# Altium schematic sheet Connectors.SchDoc
size A4; SheetNumber: 3; SheetTotal: 4
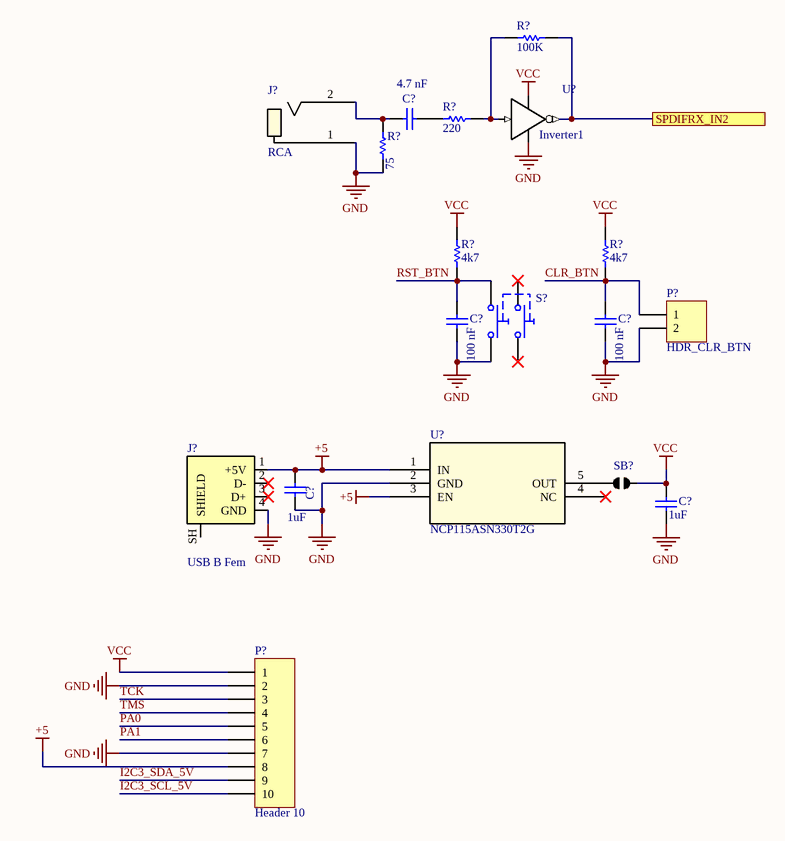
[diagram p0: Connectors.SchDoc]

## Parts
(Parts that share a designator on the sheet are numbered #1, #2 ... from top to bottom, then left to right.)
C?#1  value 4.7 nF  [RESC3216X70N]  (hidden comment: Cap)
C?#2  value 100 nF  [RESC3216X70N]  (hidden comment: Cap)
C?#3  value 100 nF  [RESC3216X70N]  (hidden comment: Cap)
C?#4  value 1uF  [CAPPRD250W50D655H1250]  (hidden comment: Cap)
C?#5  value 1uF  [CAPPRD250W50D655H1250]  (hidden comment: Cap)
J?#1  RCA  [KLPX-0848A-2-B_KYC]
J?#2  USB B Fem  [UJ2BH1TH]
P?#1  HDR_CLR_BTN  [HDR1X2]
P?#2  Header 10  [HDR1X10]
R?#1  value 100K  [RESC3216X70N]  (hidden comment: Res1)
R?#2  value 220  [RESC3216X70N]  (hidden comment: Res1)
R?#3  value 75  [RESC3216X70N]  (hidden comment: Res1)
R?#4  value 4k7  [RESC3216X70N]  (hidden comment: Res1)
R?#5  value 4k7  [RESC3216X70N]  (hidden comment: Res1)
S?  Doubl-Pole, Single-Throw Button  [TS026655BK160LCRD]  (value not drawn)
SB?  Solder Bridge  [Solder Bridge]  (value not drawn)
U?#1  Inverter1  [DBV5-M]
U?#2  NCP115ASN330T2G  [SOT95P275X120-5N]

## Ports
SPDIFRX_IN2

## Nets
+5: C?#4.2 J?#2.1(+5V) P?#2.8 U?#2.1(IN) U?#2.3(EN)
GND: C?#2.1 C?#3.1 C?#4.1 C?#5.1 J?#1.1 J?#2.4(GND) P?#1.2 P?#2.2 P?#2.7 R?#3.1 S?.4 U?#1.3(GND) U?#2.2(GND)
VCC: C?#5.2 P?#2.1 R?#4.1 R?#5.1 SB?.2 U?#1.5(VCC)
CLR_BTN: C?#3.2 P?#1.1 R?#5.2
I2C3_SCL_5V: P?#2.10
I2C3_SDA_5V: P?#2.9
PA0: P?#2.5
PA1: P?#2.6
RST_BTN: C?#2.2 R?#4.2 S?.3
SPDIFRX_IN2: R?#1.1 U?#1.4(Y) ; port SPDIFRX_IN2
TCK: P?#2.3
TMS: P?#2.4
NetC?#1_1: C?#1.1 J?#1.2 R?#3.2
NetC?#1_2: C?#1.2 R?#2.2
NetR?#1_2: R?#1.2 R?#2.1 U?#1.2(A)
NetSB?_1: SB?.1 U?#2.5(OUT)

Not connected (* = marked no-connect by the designer): J?#2 2(D-)* 3(D+)* SH(SHIELD); S? 1* 2*; U?#2 4(NC)*

## Library data of the parts
C?#1-C?#5 = Cap: Capacitor; Published: 8-Jun-2000; LatestRevisionDate: 17-Jul-2002; LatestRevisionNote: Re-released for DXP Platform.; PackageReference: RAD-0.3; Publisher: Altium Limited; PackageDescription: Radial Cap, Thru-Hole; 2 Leads; 0.3 in Pin Spacing
J?#1 = KLPX-0848A-2-B: No Description Available; Mfr_Name: KYCON, INC.; Copyright: Copyright (C) 2023 Ultra Librarian. All rights reserved.; Manufacturer_Part_Number: KLPX-0848A-2-B; RefDes: RefDes; Type: DEV
J?#2 = USB B Fem: pin to pad: SH>MH
P?#1 = Header 2: Header, 2-Pin; LatestRevisionDate: 17-Jul-2002; LatestRevisionNote: Re-released for DXP Platform.; Publisher: Altium Limited
P?#2 = Header 10: Header, 10-Pin; LatestRevisionDate: 17-Jul-2002; LatestRevisionNote: Re-released for DXP Platform.; Publisher: Altium Limited
R?#1-R?#5 = Res1: Resistor; Published: 8-Jun-2000; LatestRevisionDate: 17-Jul-2002; LatestRevisionNote: Re-released for DXP Platform.; PackageReference: AXIAL-0.3; Publisher: Altium Limited; PackageDescription: Axial Device, Thru-Hole; 2 Leads; 0.3 in Pin Spacing
S? = DPST Push Button: closed: 0; Rclosed: 1m; Ropen: 1Meg; SimulationGenericComponent: True
U?#2 = NCP115ASN330T2G: No Description Available; Mfr_Name: onsemi; Copyright: Copyright (C) 2023 Ultra Librarian. All rights reserved.; Manufacturer_Part_Number: NCP115ASN330T2G; RefDes: RefDes; Type: DEV
U?#1 = Inverter1: Supplier 1: Digi-Key; Supplier Part Number 1: 296-8487-1-ND